# EAGLE schematic akilli_olcum_cihazi (EAGLE 9.2.1)

## Sheet 1 of 2
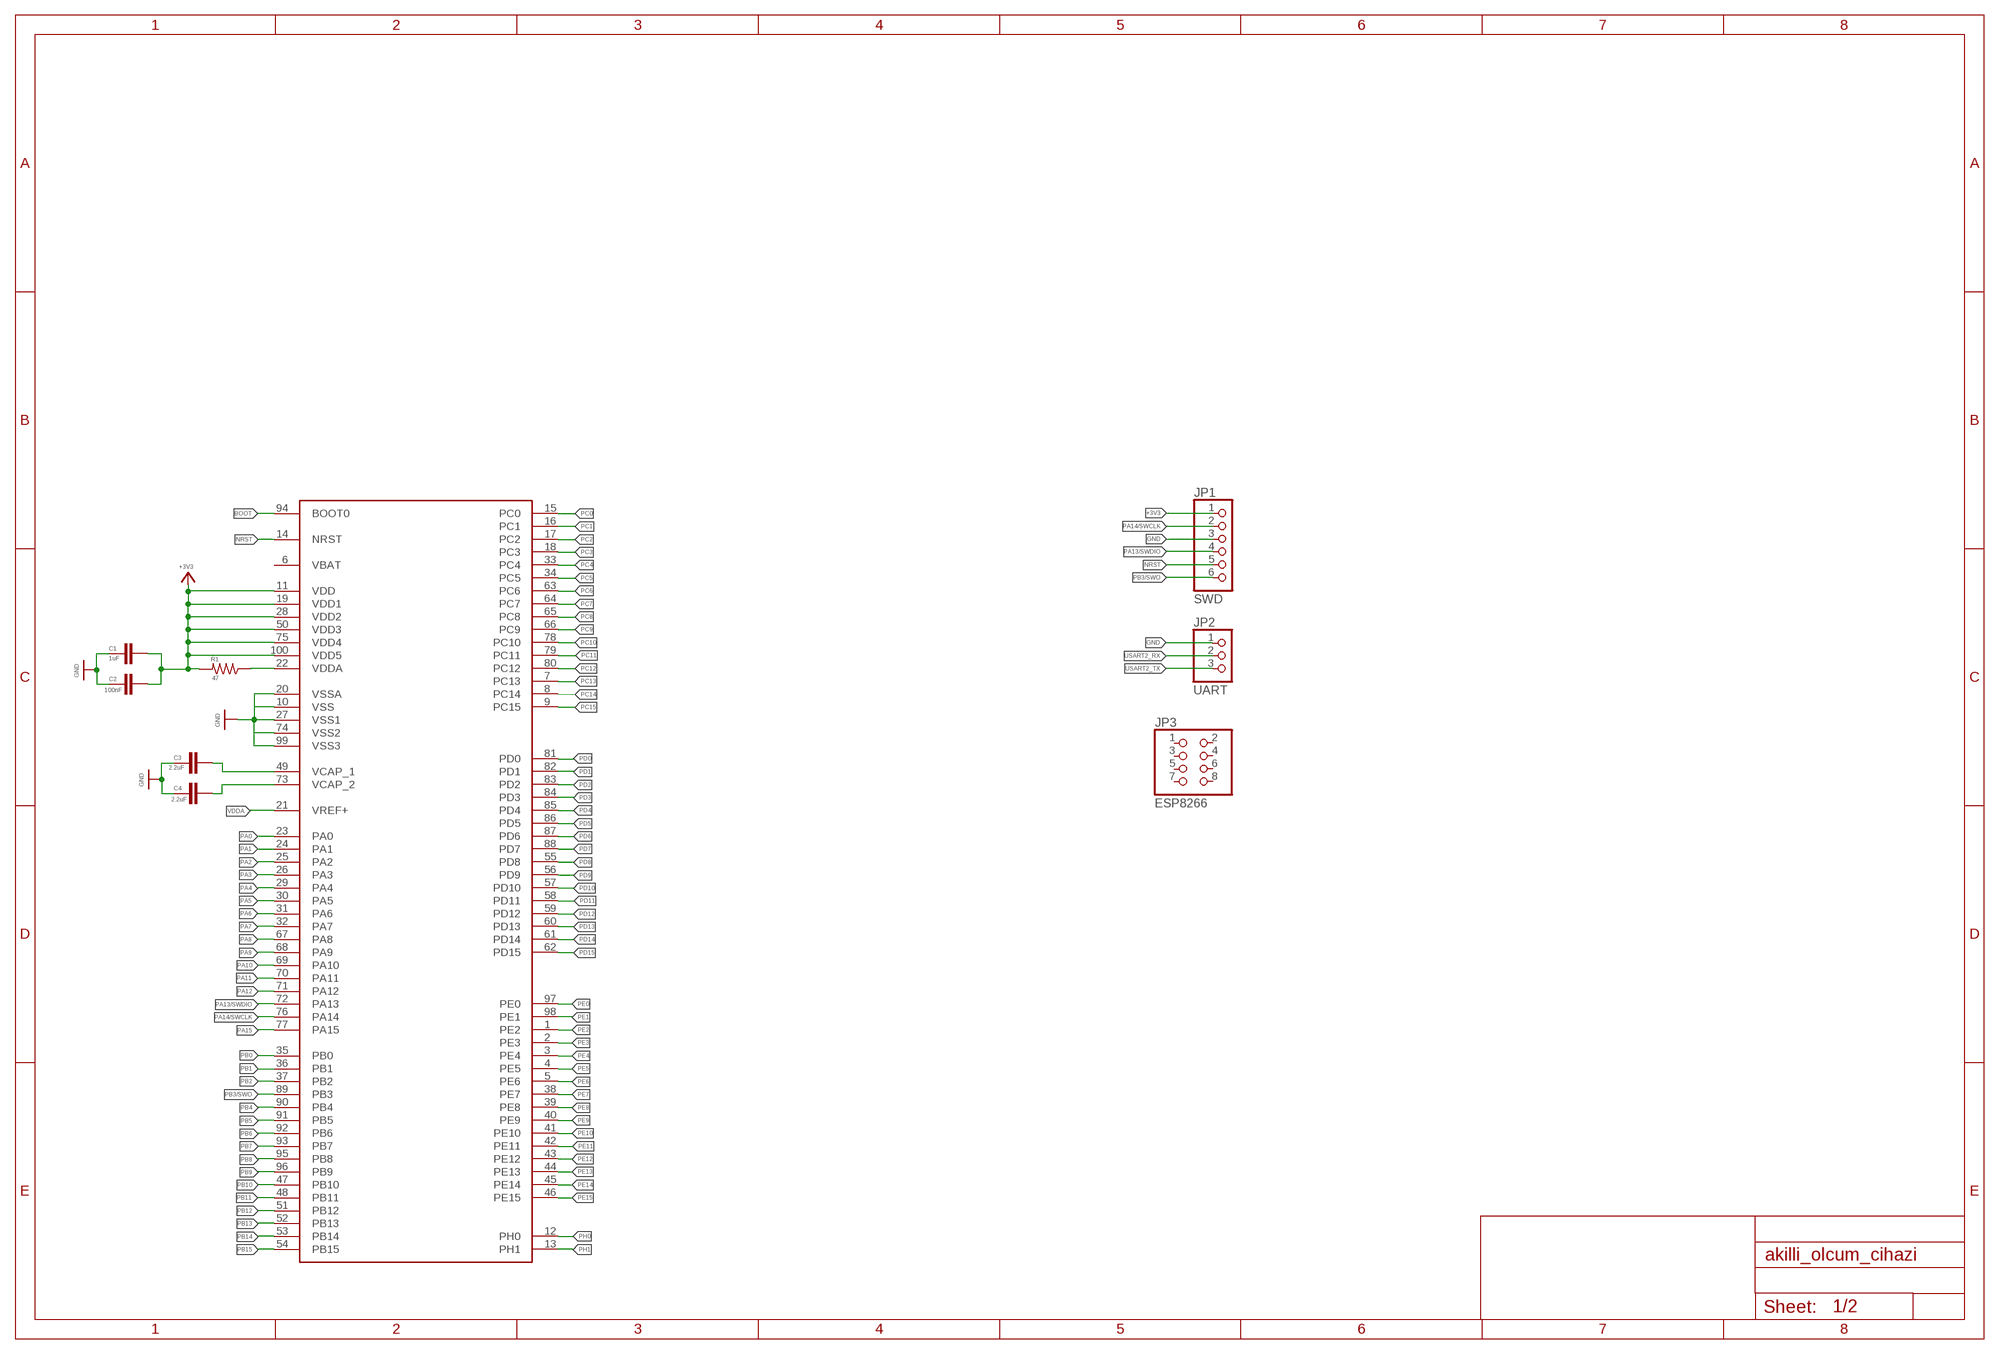
[diagram p0: schematic, sheet 1]

### Parts
C1  1uF  C  [C0805]
C2  100nF  C  [C0805]
C3  2.2uF  C  [C0805]
C4  2.2uF  C  [C0805]
JP1  SWD  PINHD-1X6  [1X06]
JP2  UART  PINHD-1X3  [1X03]
JP3  ESP8266  PINHD-2X4  [2X04]
R1  47  R-US_R1206  [R1206]
U$1  STM32F40XSTM32D40X  [LQFP100]

### Nets
+3V3: C1.2 C2.2 JP1.1 R1.2 U$1.11(VDD) U$1.19(VDD1) U$1.28(VDD2) U$1.50(VDD3) U$1.75(VDD4) U$1.100(VDD5)
BOOT: U$1.94(BOOT0)
GND: C1.1 C2.1 C3.1 C4.1 JP1.3 JP2.1 U$1.10(VSS) U$1.20(VSSA) U$1.27(VSS1) U$1.74(VSS2) U$1.99(VSS3)
N$2: C3.2 U$1.49(VCAP_1)
N$3: C4.2 U$1.73(VCAP_2)
NRST: JP1.5 U$1.14(NRST)
PA0: U$1.23(PA0)
PA1: U$1.24(PA1)
PA2: U$1.25(PA2)
PA3: U$1.26(PA3)
PA4: U$1.29(PA4)
PA5: U$1.30(PA5)
PA6: U$1.31(PA6)
PA7: U$1.32(PA7)
PA8: U$1.67(PA8)
PA9: U$1.68(PA9)
PA10: U$1.69(PA10)
PA11: U$1.70(PA11)
PA12: U$1.71(PA12)
PA13/SWDIO: JP1.4 U$1.72(PA13)
PA14/SWCLK: JP1.2 U$1.76(PA14)
PA15: U$1.77(PA15)
PB0: U$1.35(PB0)
PB1: U$1.36(PB1)
PB2: U$1.37(PB2)
PB3/SWO: JP1.6 U$1.89(PB3)
PB4: U$1.90(PB4)
PB5: U$1.91(PB5)
PB6: U$1.92(PB6)
PB7: U$1.93(PB7)
PB8: U$1.95(PB8)
PB9: U$1.96(PB9)
PB10: U$1.47(PB10)
PB11: U$1.48(PB11)
PB12: U$1.51(PB12)
PB13: U$1.52(PB13)
PB14: U$1.53(PB14)
PB15: U$1.54(PB15)
PC0: U$1.15(PC0)
PC1: U$1.16(PC1)
PC2: U$1.17(PC2)
PC3: U$1.18(PC3)
PC4: U$1.33(PC4)
PC5: U$1.34(PC5)
PC6: U$1.63(PC6)
PC7: U$1.64(PC7)
PC8: U$1.65(PC8)
PC9: U$1.66(PC9)
PC10: U$1.78(PC10)
PC11: U$1.79(PC11)
PC12: U$1.80(PC12)
PC13: U$1.7(PC13)
PC14: U$1.8(PC14)
PC15: U$1.9(PC15)
PD0: U$1.81(PD0)
PD1: U$1.82(PD1)
PD2: U$1.83(PD2)
PD3: U$1.84(PD3)
PD4: U$1.85(PD4)
PD5: U$1.86(PD5)
PD6: U$1.87(PD6)
PD7: U$1.88(PD7)
PD8: U$1.55(PD8)
PD9: U$1.56(PD9)
PD10: U$1.57(PD10)
PD11: U$1.58(PD11)
PD12: U$1.59(PD12)
PD13: U$1.60(PD13)
PD14: U$1.61(PD14)
PD15: U$1.62(PD15)
PE0: U$1.97(PE0)
PE1: U$1.98(PE1)
PE2: U$1.1(PE2)
PE3: U$1.2(PE3)
PE4: U$1.3(PE4)
PE5: U$1.4(PE5)
PE6: U$1.5(PE6)
PE7: U$1.38(PE7)
PE8: U$1.39(PE8)
PE9: U$1.40(PE9)
PE10: U$1.41(PE10)
PE11: U$1.42(PE11)
PE12: U$1.43(PE12)
PE13: U$1.44(PE13)
PE14: U$1.45(PE14)
PE15: U$1.46(PE15)
PH0: U$1.12(PH0)
PH1: U$1.13(PH1)
USART2_RX: JP2.2
USART2_TX: JP2.3
VDDA: R1.1 U$1.21(VREF+) U$1.22(VDDA)
Unconnected: JP3.1 JP3.2 JP3.3 JP3.4 JP3.5 JP3.6 JP3.7 JP3.8 U$1.6(VBAT)

## Sheet 2 of 2
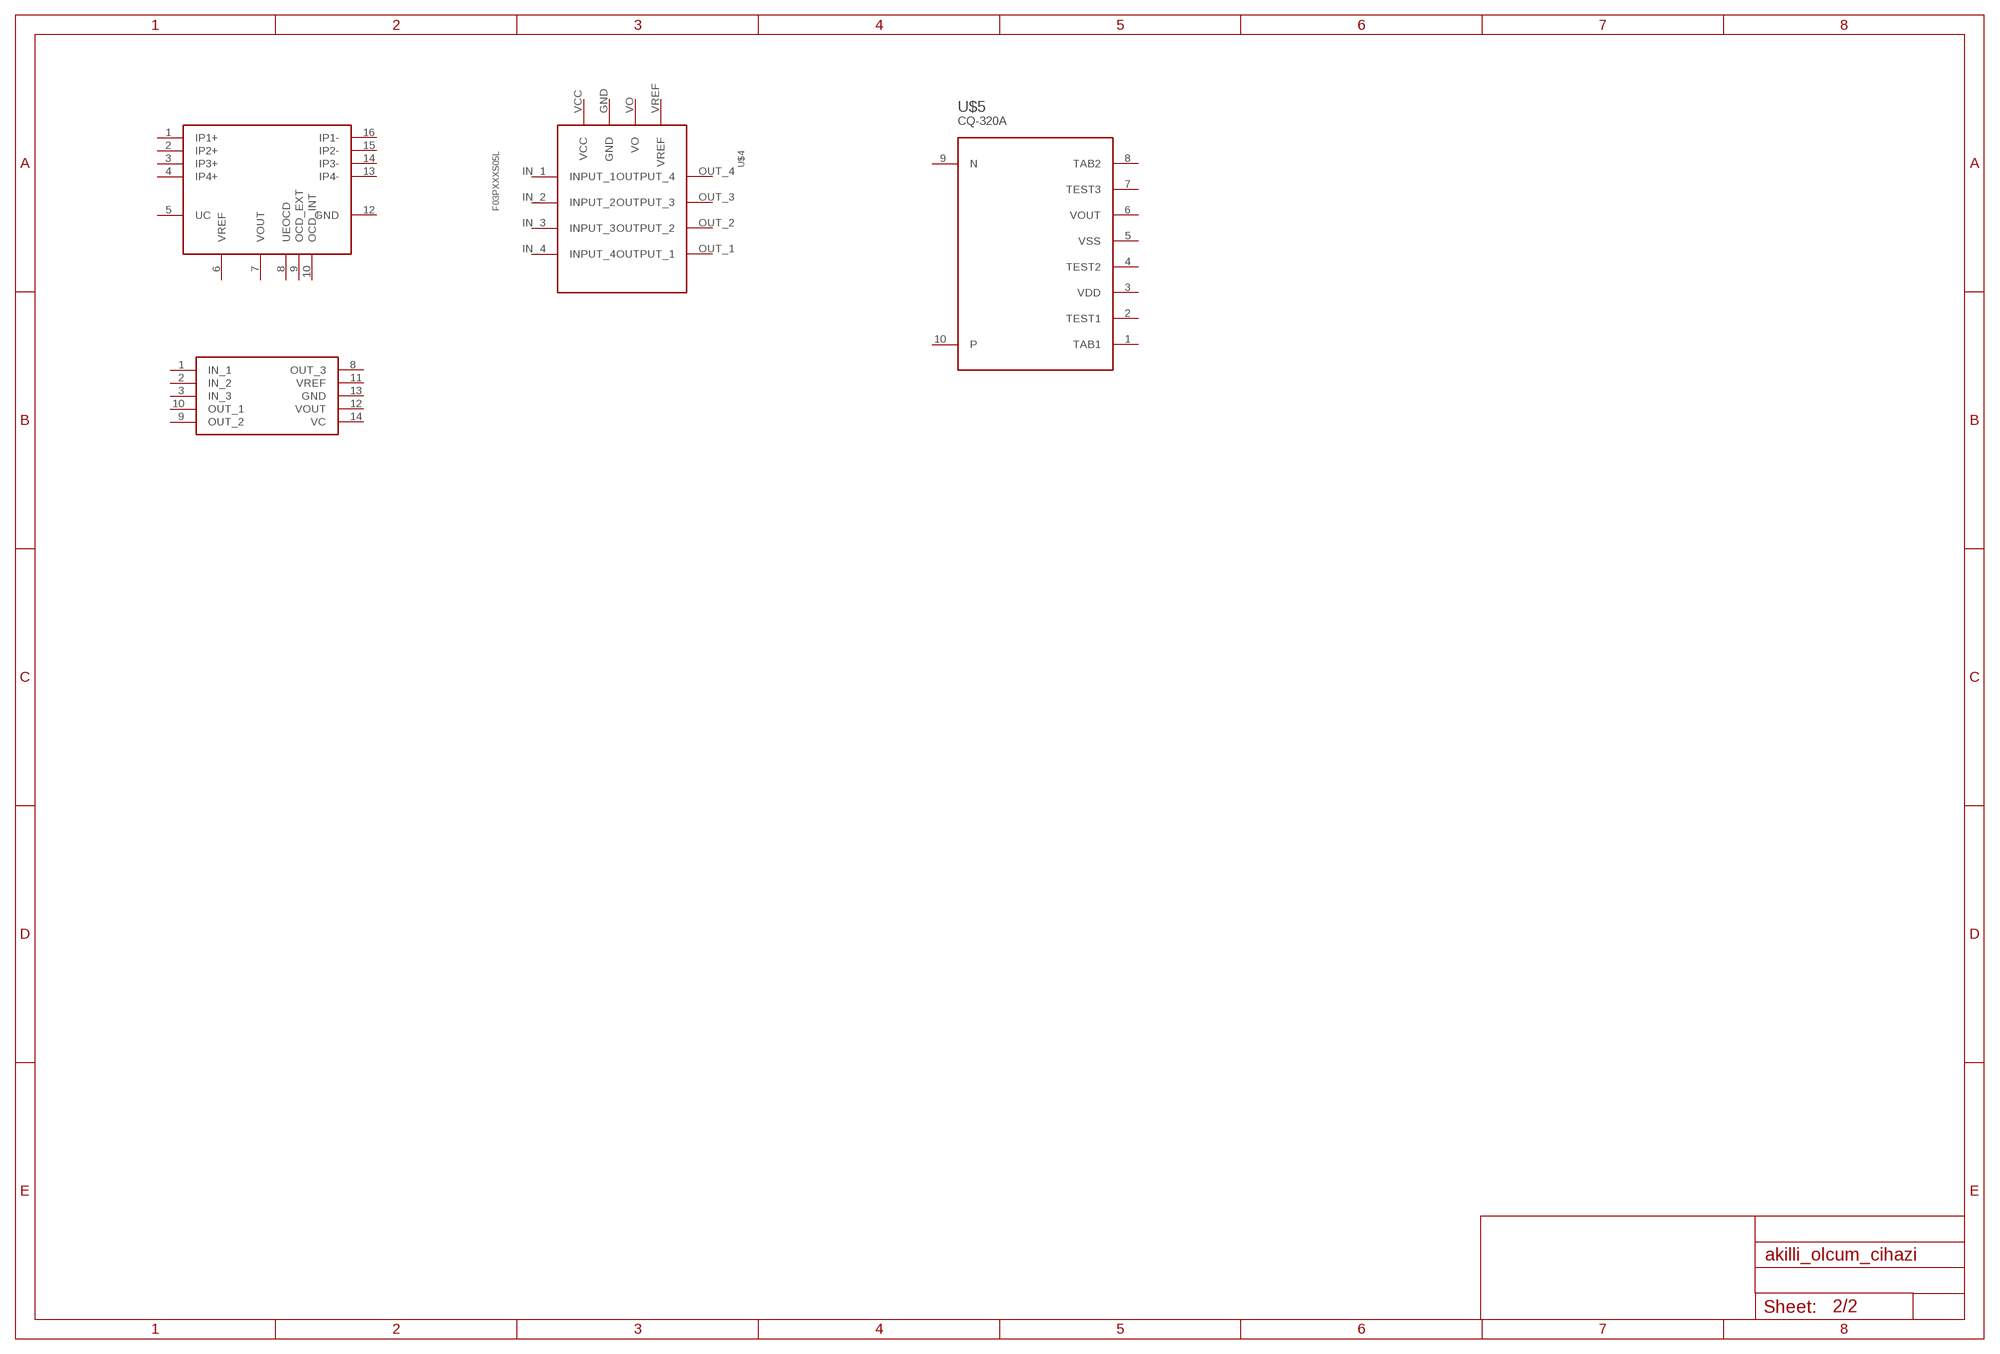
[diagram p1: schematic, sheet 2]

### Parts
U$2  LEM_G02  [LEM_G02]
U$3  LEM_CASR  [LEM]
U$4  F03PXXXS05L  [F03PXXXS05L]
U$5  CQ-320A  [CQ-320A]
Unconnected: U$2.1(IP1+) U$2.2(IP2+) U$2.3(IP3+) U$2.4(IP4+) U$2.5(UC) U$2.6(VREF) U$2.7(VOUT) U$2.8(UEOCD) U$2.9(OCD_EXT) U$2.10(OCD_INT) U$2.12(GND) U$2.13(IP4-) U$2.14(IP3-) U$2.15(IP2-) U$2.16(IP1-) U$3.1(IN_1) U$3.2(IN_2) U$3.3(IN_3) U$3.8(OUT_3) U$3.9(OUT_2) U$3.10(OUT_1) U$3.11(VREF) U$3.12(VOUT) U$3.13(GND) U$3.14(VC) U$4.GND U$4.IN_1(INPUT_1) U$4.IN_2(INPUT_2) U$4.IN_3(INPUT_3) U$4.IN_4(INPUT_4) U$4.OUT_1(OUTPUT_1) U$4.OUT_2(OUTPUT_2) U$4.OUT_3(OUTPUT_3) U$4.OUT_4(OUTPUT_4) U$4.VCC U$4.VO U$4.VREF U$5.1(TAB1) U$5.2(TEST1) U$5.3(VDD) U$5.4(TEST2) U$5.5(VSS) U$5.6(VOUT) U$5.7(TEST3) U$5.8(TAB2) U$5.9(N) U$5.10(P)

## Library data of the parts
C1-C4 = eagle-ltspice:C: CAPACITOR, European symbol; SPICEMODEL: NONE; SPICEPREFIX: C
JP1 = pinhead:PINHD-1X6: PIN HEADER
JP2 = pinhead:PINHD-1X3: PIN HEADER
JP3 = pinhead:PINHD-2X4: PIN HEADER
R1 = adafruit:R-US_: RESISTOR, American symbol
U$1 = stm32f:STM32F40X: Features • Core: ARM 32-bit Cortex™-M4 CPU with FPU, Adaptive real-time accelerator (ART Accelerator™) allowing 0-wait state execution from Flash memory, frequency up to 168 MHz, memory protection unit, 210 DMIPS/ 1.25 DMIPS/MHz (Dhrystone 2.1), and DSP instructions • Memories – Up to 1 Mbyte of Flash memory – Up to 192+4 Kbytes of SRAM including 64- Kbyte of CCM (core coupled memory) data RAM – Flexible static memory controller supporting Compact Flash, SRAM, PSRAM, NOR and NAND memories • LCD parallel interface, 8080/6800 modes • Clock, reset and supply management – 1.8 V to 3.6 V application supply and I/Os – POR, PDR, PVD and BOR – 4-to-26 MHz crystal oscillator – Internal 16 MHz factory-trimmed RC (1% accuracy) – 32 kHz oscillator for RTC with calibration – Internal 32 kHz RC with calibration • Low power – Sleep, Stop and Standby modes – VBAT supply for RTC, 20×32 bit backup registers + optional 4 KB backup SRAM • 3×12-bit, 2.4 MSPS A/D converters: up to 24 channels and 7.2 MSPS in triple interleaved mode • 2×12-bit D/A converters • General-purpose DMA: 16-stream DMA controller with FIFOs and burst support • Up to 17 timers: up to twelve 16-bit and two 32- bit timers up to 168 MHz, each with up to 4 IC/OC/PWM or pulse counter and quadrature (incremental) encoder input • Debug mode – Serial wire debug (SWD) & JTAG interfaces – Cortex-M4 Embedded Trace Macrocell™ • Up to 140 I/O ports with interrupt capability – Up to 136 fast I/Os up to 84 MHz – Up to 138 5 V-tolerant I/Os • Up to 15 communication interfaces – Up to 3 × I2C interfaces (SMBus/PMBus) – Up to 4 USARTs/2 UARTs (10.5 Mbit/s, ISO 7816 interface, LIN, IrDA, modem control) – Up to 3 SPIs (42 Mbits/s), 2 with muxed full-duplex I2S to achieve audio class accuracy via internal audio PLL or external clock – 2 × CAN interfaces (2.0B Active) – SDIO interface • Advanced connectivity – USB 2.0 full-speed device/host/OTG controller with on-chip PHY – USB 2.0 high-speed/full-speed device/host/OTG controller with dedicated DMA, on-chip full-speed PHY and ULPI – 10/100 Ethernet MAC with dedicated DMA: supports IEEE 1588v2 hardware, MII/RMII • 8- to 14-bit parallel camera interface up to 54 Mbytes/s • True random number generator • CRC calculation unit • 96-bit unique ID • RTC: subsecond accuracy, hardware calendar
U$2 = LEM G02:LEM_G02
U$3 = LEMCASR 15-NP:LEM_CASR
U$4 = F03PXXXS05L:F03PXXXS05L
U$5 = herenkeskin:CQ-320A